# EasyEDA Pro project ProPrj_集成分电板_2025-09-23.epro

# Schematic Schematic1
Board Name: Board1; Create Date: 2025-09-23; Page Name: P1; Project Name: 集成分电板; Schematic Name: Schematic1; Update Date: 2025-09-23; Company: 嘉立创EDA; Page Size: A3; Version: V1.0
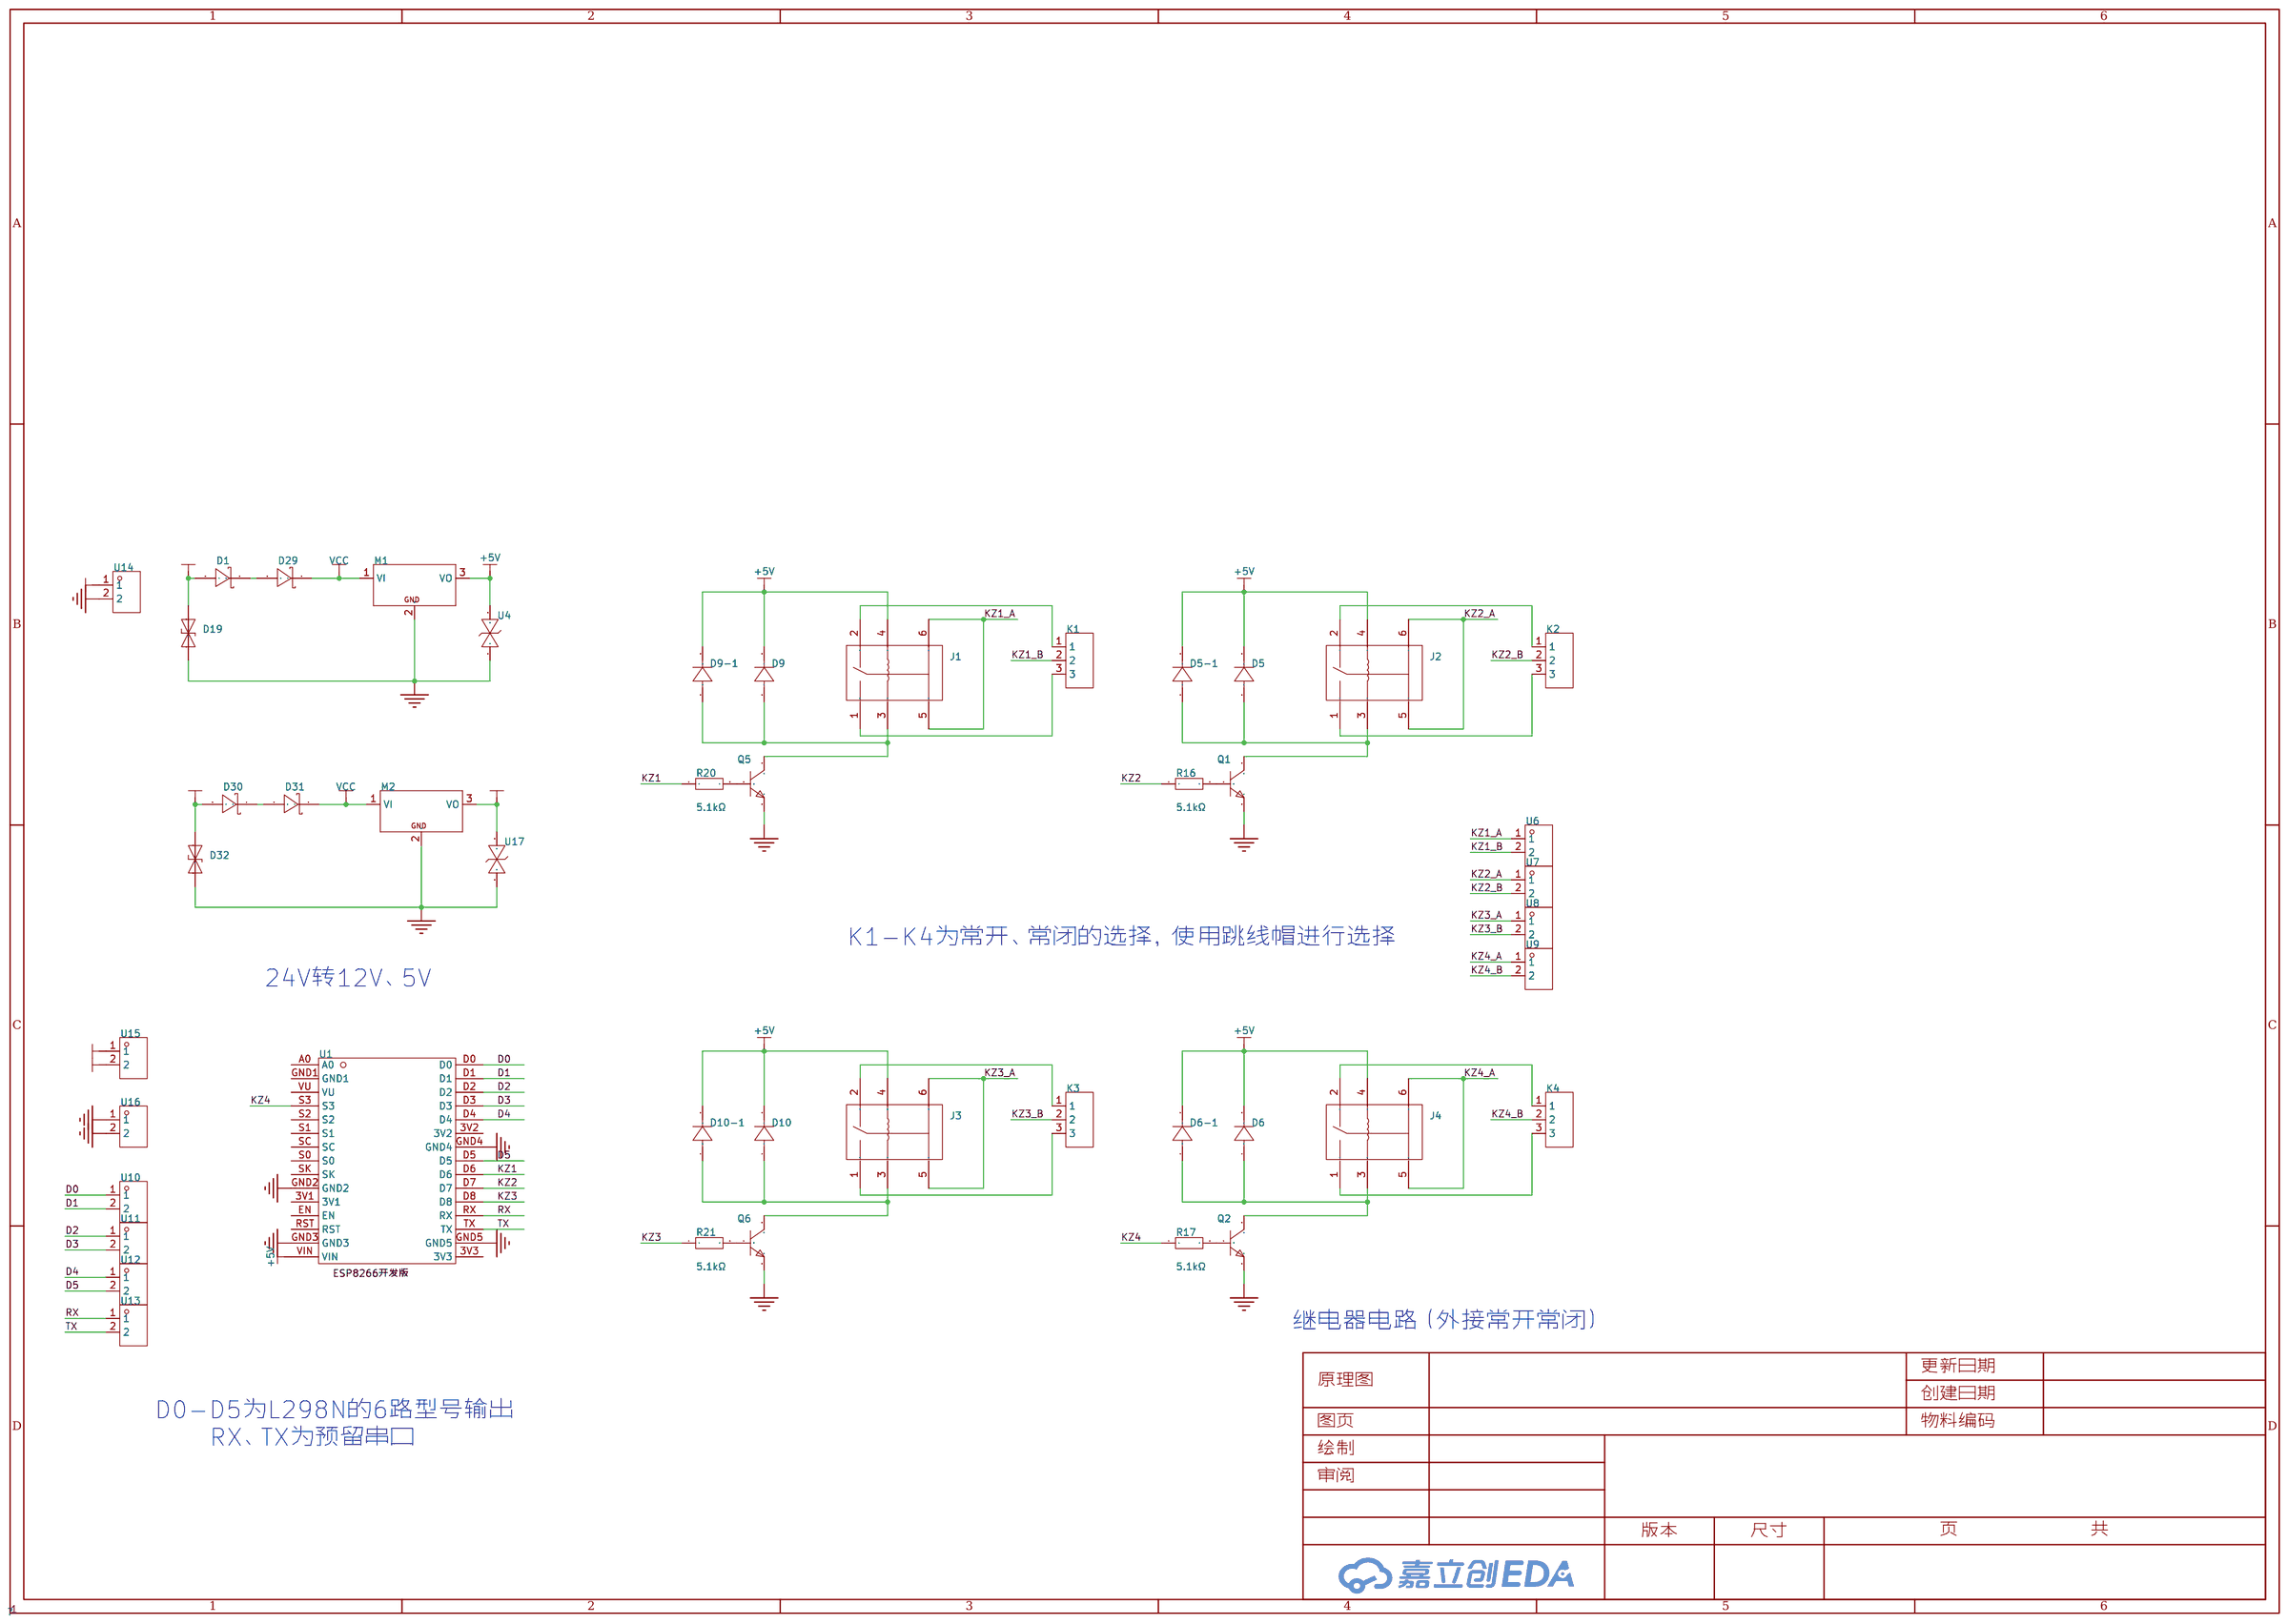
[diagram p0: schematic sheet]

## Parts
D1  SS14  [SMA_L4.2-W2.6-LS5.0-RD_1]
D5  1N4148WS  [SOD-323_L1.7-W1.3-LS2.5-FD]
D5-1  1N4148WS  [SOD-323_L1.7-W1.3-LS2.5-FD]
D6  1N4148WS  [SOD-323_L1.7-W1.3-LS2.5-FD]
D6-1  1N4148WS  [SOD-323_L1.7-W1.3-LS2.5-FD]
D9  1N4148WS  [SOD-323_L1.7-W1.3-LS2.5-FD]
D9-1  1N4148WS  [SOD-323_L1.7-W1.3-LS2.5-FD]
D10  1N4148WS  [SOD-323_L1.7-W1.3-LS2.5-FD]
D10-1  1N4148WS  [SOD-323_L1.7-W1.3-LS2.5-FD]
D19  SMCJ33CA  [SMC_L6.9-W5.9-LS7.9-BI]
D29  SS14  [SMA_L4.2-W2.6-LS5.0-RD_1]
D30  SS14  [SMA_L4.2-W2.6-LS5.0-RD_1]
D31  SS14  [SMA_L4.2-W2.6-LS5.0-RD_1]
D32  SMCJ33CA  [SMC_L6.9-W5.9-LS7.9-BI]
J1  HK4100F-DC5V-SHG  [RELAY-TH_HK4100F-DC5V-SHG]
J2  HK4100F-DC5V-SHG  [RELAY-TH_HK4100F-DC5V-SHG]
J3  HK4100F-DC5V-SHG  [RELAY-TH_HK4100F-DC5V-SHG]
J4  HK4100F-DC5V-SHG  [RELAY-TH_HK4100F-DC5V-SHG]
K1  PZ254V-11-03P  [HDR-TH_3P-P2.54-V-M]
K2  PZ254V-11-03P  [HDR-TH_3P-P2.54-V-M]
K3  PZ254V-11-03P  [HDR-TH_3P-P2.54-V-M]
K4  PZ254V-11-03P  [HDR-TH_3P-P2.54-V-M]
M1  K78L05-1000R3  [精英数智-24V转5V模块]
M2  K78L12-1000R3  [精英数智-24V转5V模块]
Q1  S9014  [SOT-23-3_L2.9-W1.3-P1.90-LS2.4-BR]
Q2  S9014  [SOT-23-3_L2.9-W1.3-P1.90-LS2.4-BR]
Q5  S9014  [SOT-23-3_L2.9-W1.3-P1.90-LS2.4-BR]
Q6  S9014  [SOT-23-3_L2.9-W1.3-P1.90-LS2.4-BR]
R16  5.1kΩ  [R0603]
R17  5.1kΩ  [R0603]
R20  5.1kΩ  [R0603]
R21  5.1kΩ  [R0603]
U1  -  [ESP8266开发板]
U4  SMBJ5.0CA  [SMB_L4.5-W3.6-LS5.2-BI]
U6  KF7.62-2P(green)  [CONN-TH_2P-P7.62_KEFA_KF7.62-2P]
U7  KF7.62-2P(green)  [CONN-TH_2P-P7.62_KEFA_KF7.62-2P]
U8  KF7.62-2P(green)  [CONN-TH_2P-P7.62_KEFA_KF7.62-2P]
U9  KF7.62-2P(green)  [CONN-TH_2P-P7.62_KEFA_KF7.62-2P]
U10  KF7.62-2P(green)  [CONN-TH_2P-P7.62_KEFA_KF7.62-2P]
U11  KF7.62-2P(green)  [CONN-TH_2P-P7.62_KEFA_KF7.62-2P]
U12  KF7.62-2P(green)  [CONN-TH_2P-P7.62_KEFA_KF7.62-2P]
U13  KF7.62-2P(green)  [CONN-TH_2P-P7.62_KEFA_KF7.62-2P]
U14  KF7.62-2P(green)  [CONN-TH_2P-P7.62_KEFA_KF7.62-2P]
U15  KF7.62-2P(green)  [CONN-TH_2P-P7.62_KEFA_KF7.62-2P]
U16  KF7.62-2P(green)  [CONN-TH_2P-P7.62_KEFA_KF7.62-2P]
U17  SMBJ12CA  [SMB_L4.6-W3.6-LS5.3-BI]

## Library data of the parts
D1 D29-D31 = SS14_C2480: 二极管配置:独立式;正向压降(Vf):550mV@1A;直流反向耐压(Vr):40V;整流电流:1A;; LCSC Part Name: 电压:40V 电流:1A; Supplier Part: C2480; Manufacturer: MDD(辰达半导体); Supplier Footprint: SMA(DO-214AC); JLCPCB Part Class: 基础库; Datasheet: https://atta.szlcsc.com/upload/public/pdf/source/20241121/B157EB417161760A7ED23035C0FAAB28.pdf; Supplier: LCSC; Diode Configuration: 独立式; Voltage - Forward(Vf@If): 550mV@1A; Voltage - DC Reverse(Vr): 40V; Current - Rectified: 1A; Reverse Leakage Current (Ir): 300uA@40V
D5 D5-1 D6 D6-1 D9 D9-1 D10 D10-1 = 1N4148WS_C7420319: 二极管配置:独立式;正向压降(Vf):1.25V@150mA;直流反向耐压(Vr):100V;整流电流:150mA;反向恢复时间(Trr):4ns;; Supplier Part: C7420319; Manufacturer: 宏嘉诚; Supplier Footprint: SOD-323; JLCPCB Part Class: Extended Part; Datasheet: https://item.szlcsc.com/datasheet/1N4148WS/8397141.html; Supplier: LCSC; Diode Configuration: 独立式; Forward Voltage (Vf@If): 1.25V@150mA; Reverse Voltage (Vr): 100V; Rectified Current: 150mA; Reverse Leakage Current (Ir): 1uA@75V; Reverse Recovery Time (trr): 4ns; Operating Temperature: -55℃~+150℃; Voltage - Forward(Vf@If): 1.25V@150mA; Voltage - DC Reverse(Vr): 100V; Current - Rectified: 150mA; Pd - Power Dissipation: 200mW; Operating Junction Temperature Range: -55℃~+150℃; Non-Repetitive Peak Forward Surge Current: 2A
D19 D32 = SMCJ33CA: 反向截止电压(Vrwm):33V;最大钳位电压:53.3V;峰值脉冲电流(Ipp):28.2A;击穿电压:36.7V;; Supplier Part: C356787; Manufacturer: JJW(捷捷微); Supplier Footprint: SMC(DO-214AB); Datasheet: https://atta.szlcsc.com/upload/public/pdf/source/20181226/C356793_C1FF0BB4994669FE0B6214A04E00432E.pdf; Supplier: LCSC; Reverse Stand-Off Voltage (Vrwm): 33V; Maximum Clamping Voltage: 53.3V; Peak Pulse Current (Ipp): 28.2A; Breakdown Voltage: 36.7V; Reverse Leakage Current (Ir): 1uA; Type: TVS
J1-J4 = HK4100F-DC5V-SHG: 线圈电压:-;触点形式:-;触点容量(电阻负载):-;最大切换电压:-;最大切换电流:-;; Supplier Part: C12072; Manufacturer: 汇科; Supplier Footprint: DIP,10.5x14.5mm; JLCPCB Part Class: Extended Part; Datasheet: https://atta.szlcsc.com/upload/public/pdf/source/20180316/5A66D26635AF047552DED4727B242686.pdf; Supplier: LCSC
K1-K4 = PZ254V-11-03P: 插针结构:1x3P;间距:2.54mm;行距:-;圆针/方针:方针;安装方式:直插;排数:单排;总PIN位数:3P;额定电流:3A;额定电压:250V;配合针长度:6mm;塑高:2.5mm;端接针长度:3mm;工作温度:-40℃~+105℃;颜色:黑色;; LCSC Part Name: 1x3P 间距:2.54mm 方针 直插; Supplier Part: C2937625; Manufacturer: XFCN(兴飞); Supplier Footprint: 插件,P=2.54mm; JLCPCB Part Class: Extended Part; Datasheet: https://item.szlcsc.com/datasheet/PZ254V-11-03P/3293280.html; Supplier: LCSC; Pin Structure: 1x3P; Pitch: 2.54mm; Circluar Pins/Square Pins: 方针; Mounting Type: 直插; Number of Rows: 单排; Number of Pins: 3P; Current Rating: 3A; Voltage Rating (Max): 250V; Length of Mating Pin: 6mm; Insulation Height: 2.5mm; Length of End Connection Pin: 3mm; Operating Temperature: -40℃~+105℃; Color: 黑色
M1 = K78L05-1000R3: 可正负配置  宽压输入 高效率 高性价比 无需散热 短路保护 支持负电压; LCSC Part Name: DC/DC模块电源，宽电压输入，非隔离稳压单路输出; Supplier Part: C115813; Manufacturer: MORNSUN(金升阳); Supplier Footprint: SIP,11.5x7.5mm; JLCPCB Part Class: Extended Part; Datasheet: https://item.szlcsc.com/datasheet/K78L05-1000R3/117064.html; Supplier: LCSC; Number of Outputs: 1; Voltage - Supply: 8V~36V; Output Voltage: -5V；5V; Output Current(Max): 1A；-500mA; Conversion Efficiency: 86%；93%
M2 = K78L12-1000R3: 可正负配置  宽压输入 高效率 高性价比 无需散热 短路保护 支持负电压; LCSC Part Name: DC/DC模块电源，宽电压输入，非隔离稳压单路输出; Supplier Part: C115814; Manufacturer: MORNSUN(金升阳); Supplier Footprint: SIP,11.5x7.5mm; JLCPCB Part Class: Extended Part; Datasheet: https://item.szlcsc.com/datasheet/K78L12-1000R3/117065.html; Supplier: LCSC; Number of Outputs: 1; Voltage - Supply: 8V~36V; Output Voltage: -12V；12V; Output Current(Max): 1A；-300mA; Conversion Efficiency: 89%；96%
Q1 Q2 Q5 Q6 = S9014_C2148: 晶体管类型:NPN;集电极电流(Ic):100mA;集射极击穿电压(Vceo):45V;耗散功率(Pd):200mW;直流电流增益(hFE):200@1mA,5V;; LCSC Part Name: J6  300-400 NPN 电流:0.1A 电压:45V; Supplier Part: C2148; Manufacturer: CJ(江苏长电/长晶); Supplier Footprint: SOT-23; JLCPCB Part Class: Extended Part; Datasheet: https://item.szlcsc.com/datasheet/S9014/2505.html; Supplier: LCSC; type: NPN; Current - Collector(Ic): 100mA; Collector - Emitter Voltage VCEO: 45V; Pd - Power Dissipation: 200mW; DC Current Gain: 200@1mA,5V; Transition frequency(fT): 150MHz; Current - Collector Cutoff: 100nA; Vce Saturation(VCE(sat)): 300mV@100mA,5mA; Operating Temperature: -55℃~+150℃; Emitter-Base Voltage(Vebo): 5V; Number: 1个NPN
R16 R17 R20 R21 = 0603WAF5101T5E: 电阻类型:厚膜电阻;阻值:5.1kΩ;精度:±1%;功率:100mW;工作电压:75V;温度系数:±100ppm/℃;; LCSC Part Name: 5.1kΩ ±1% 100mW 厚膜电阻; Supplier Part: C23186; Manufacturer: UNI-ROYAL(厚声); Supplier Footprint: 0603; JLCPCB Part Class: Basic Part; Datasheet: https://item.szlcsc.com/datasheet/0603WAF5101T5E/23913.html; Supplier: LCSC; Type: 厚膜电阻; Tolerance: ±1%; Power(Watts): 100mW; Voltage-Supply(Max): 75V; Temperature Coefficient: ±100ppm/℃; Operating Temperature: -55℃~+155℃
U1 = ESP8266开发板
U4 = SMBJ5.0CA_C19077559: 极性:双向;反向截止电压(Vrwm):5V;钳位电压:9.2V;峰值脉冲电流(Ipp):65.22A;峰值脉冲功率(Ppp):600W;击穿电压:7V;; Supplier Part: C19077559; Manufacturer: 宏嘉诚; Supplier Footprint: SMB; JLCPCB Part Class: 扩展库; Datasheet: https://atta.szlcsc.com/upload/public/pdf/source/20250107/474F05451FC8AB27D7FA0238914F96F6.pdf; Supplier: LCSC; Polarity: 双向; Reverse Stand-Off Voltage (Vrwm): 5V; Clamping Voltage: 9.2V; Peak Pulse Current (Ipp): 65.22A; Peak Pulse Power Dissipation (Ppp): 600W; Voltage - Breakdown: 7V; Reverse Leakage Current (Ir): 800uA; Type: TVS
U6-U16 = KF7.62-2P(green): LCSC Part Name: 绿色尼龙环保 KF7.62-2P(green); Supplier Part: C5173665; Manufacturer: KEFA(科发); Supplier Footprint: 插件,P=7.62mm; JLCPCB Part Class: Extended Part; Datasheet: https://item.szlcsc.com/datasheet/KF7.62-2P(green)/5823755.html; Supplier: LCSC
U17 = SMBJ12CA_C83849: 极性:双向;反向截止电压(Vrwm):12V;钳位电压:19.9V;峰值脉冲电流(Ipp):30.2A;峰值脉冲功率(Ppp):600W;击穿电压:13.3V;; Supplier Part: C83849; Manufacturer: Littelfuse(美国力特); Supplier Footprint: SMB(DO-214AA); JLCPCB Part Class: Extended Part; Datasheet: https://item.szlcsc.com/datasheet/SMBJ12CA/85016.html; Supplier: LCSC; Polarity: 双向; Reverse Stand-Off Voltage (Vrwm): 12V; Clamping Voltage: 19.9V; Peak Pulse Current (Ipp): 30.2A; Peak Pulse Power Dissipation (Ppp): 600W; Voltage - Breakdown: 13.3V; Type: TVS

## Nets
+5V: D5.2(K) D5-1.2(K) D6.2(K) D6-1.2(K) D9.2(K) D9-1.2(K) D10.2(K) D10-1.2(K) J1.4 J2.4 J3.4 J4.4 M1.3(VO) U1.VIN U4.2
+12V: M2.3(VO) U15.1 U15.2 U17.2
+24V: D1.2(A) D19.2(A) D30.2(A) D32.2(A) U14.1
GND: D19.1(K) D32.1(K) M1.2(GND) M2.2(GND) Q1.2(E) Q2.2(E) Q5.2(E) Q6.2(E) U1.GND2 U1.GND3 U1.GND4 U1.GND5 U4.1 U14.2 U16.1 U16.2 U17.1
VCC: D29.1(K) D31.1(K) M1.1(VI) M2.1(VI)
D0: U1.D0 U10.1
D1: U1.D1 U10.2
D2: U1.D2 U11.1
D3: U1.D3 U11.2
D4: U1.D4 U12.1
D5: U1.D5 U12.2
KZ1: R20.1 U1.D6
KZ1_A: J1.5 J1.6 U6.1
KZ1_B: K1.2 U6.2
KZ2: R16.1 U1.D7
KZ2_A: J2.5 J2.6 U7.1
KZ2_B: K2.2 U7.2
KZ3: R21.1 U1.D8
KZ3_A: J3.5 J3.6 U8.1
KZ3_B: K3.2 U8.2
KZ4: R17.1 U1.S3
KZ4_A: J4.5 J4.6 U9.1
KZ4_B: K4.2 U9.2
RX: U1.RX U13.1
TX: U1.TX U13.2
$1N2963: Q5.1(B) R20.2
$1N2967: D9.1(A) D9-1.1(A) J1.3 Q5.3(C)
$1N2971: J1.2 K1.1
$1N2972: J1.1 K1.3
$1N2975: Q1.1(B) R16.2
$1N2979: D5.1(A) D5-1.1(A) J2.3 Q1.3(C)
$1N2983: J2.2 K2.1
$1N2984: J2.1 K2.3
$1N2987: Q6.1(B) R21.2
$1N2991: D10.1(A) D10-1.1(A) J3.3 Q6.3(C)
$1N2995: J3.2 K3.1
$1N2996: J3.1 K3.3
$1N2999: Q2.1(B) R17.2
$1N3003: D6.1(A) D6-1.1(A) J4.3 Q2.3(C)
$1N3007: J4.2 K4.1
$1N3008: J4.1 K4.3
$1N3859: D1.1(K) D29.2(A)
$1N4413: D30.1(K) D31.2(A)

Not connected (* = marked no-connect by the designer): U1 3V1 3V2 3V3 A0 EN GND1 RST S0 S1 S2 SC SK VU

## Notes on the sheet
- K1-K4为常开、常闭的选择，使用跳线帽进行选择
- 24V转12V、5V
- 继电器电路（外接常开常闭）
- D0-D5为L298N的6路型号输出
- RX、TX为预留串口

# Board PCB1
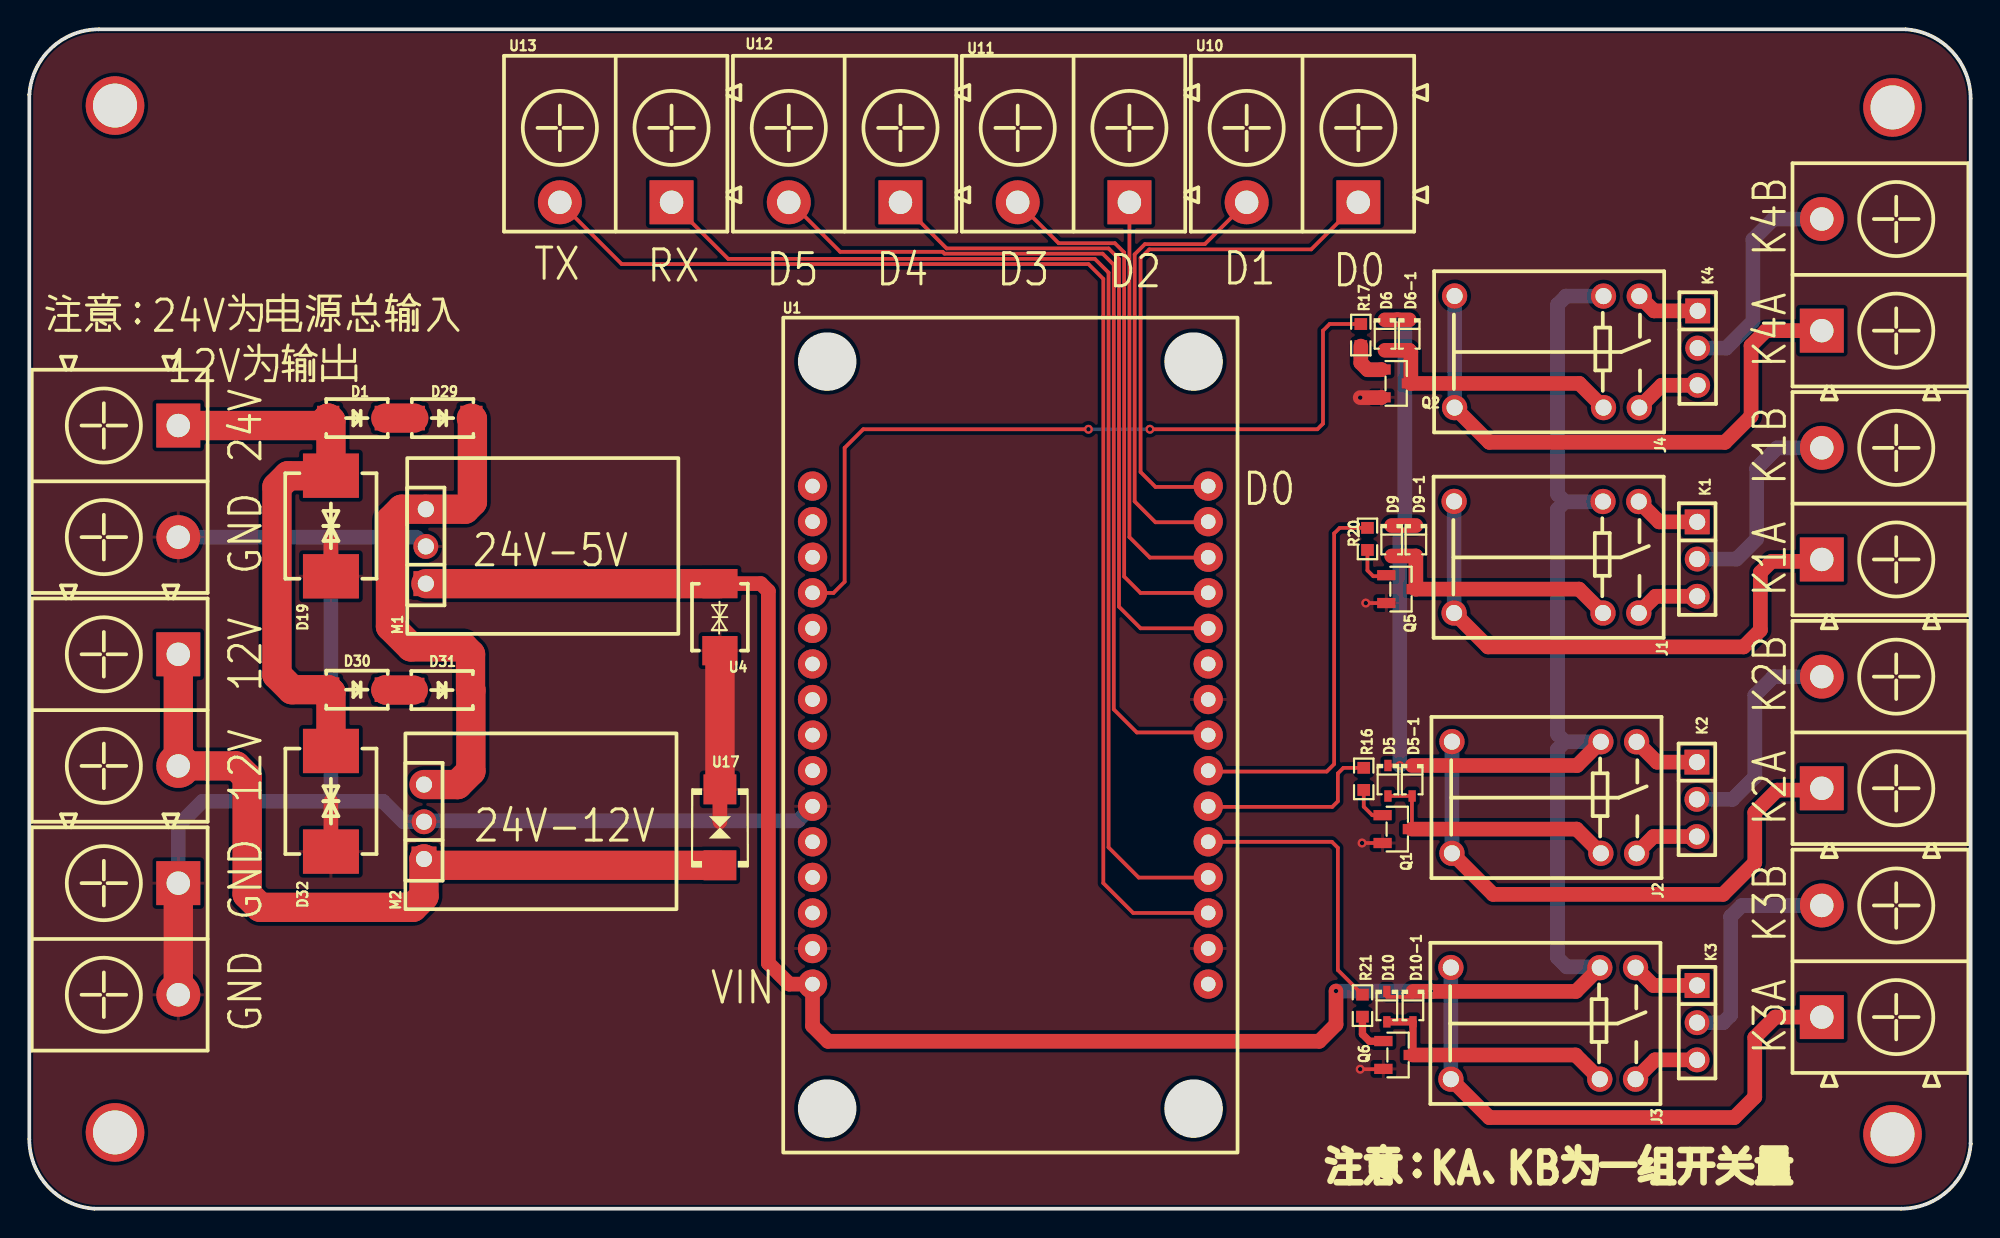
[diagram p1: board, top side]
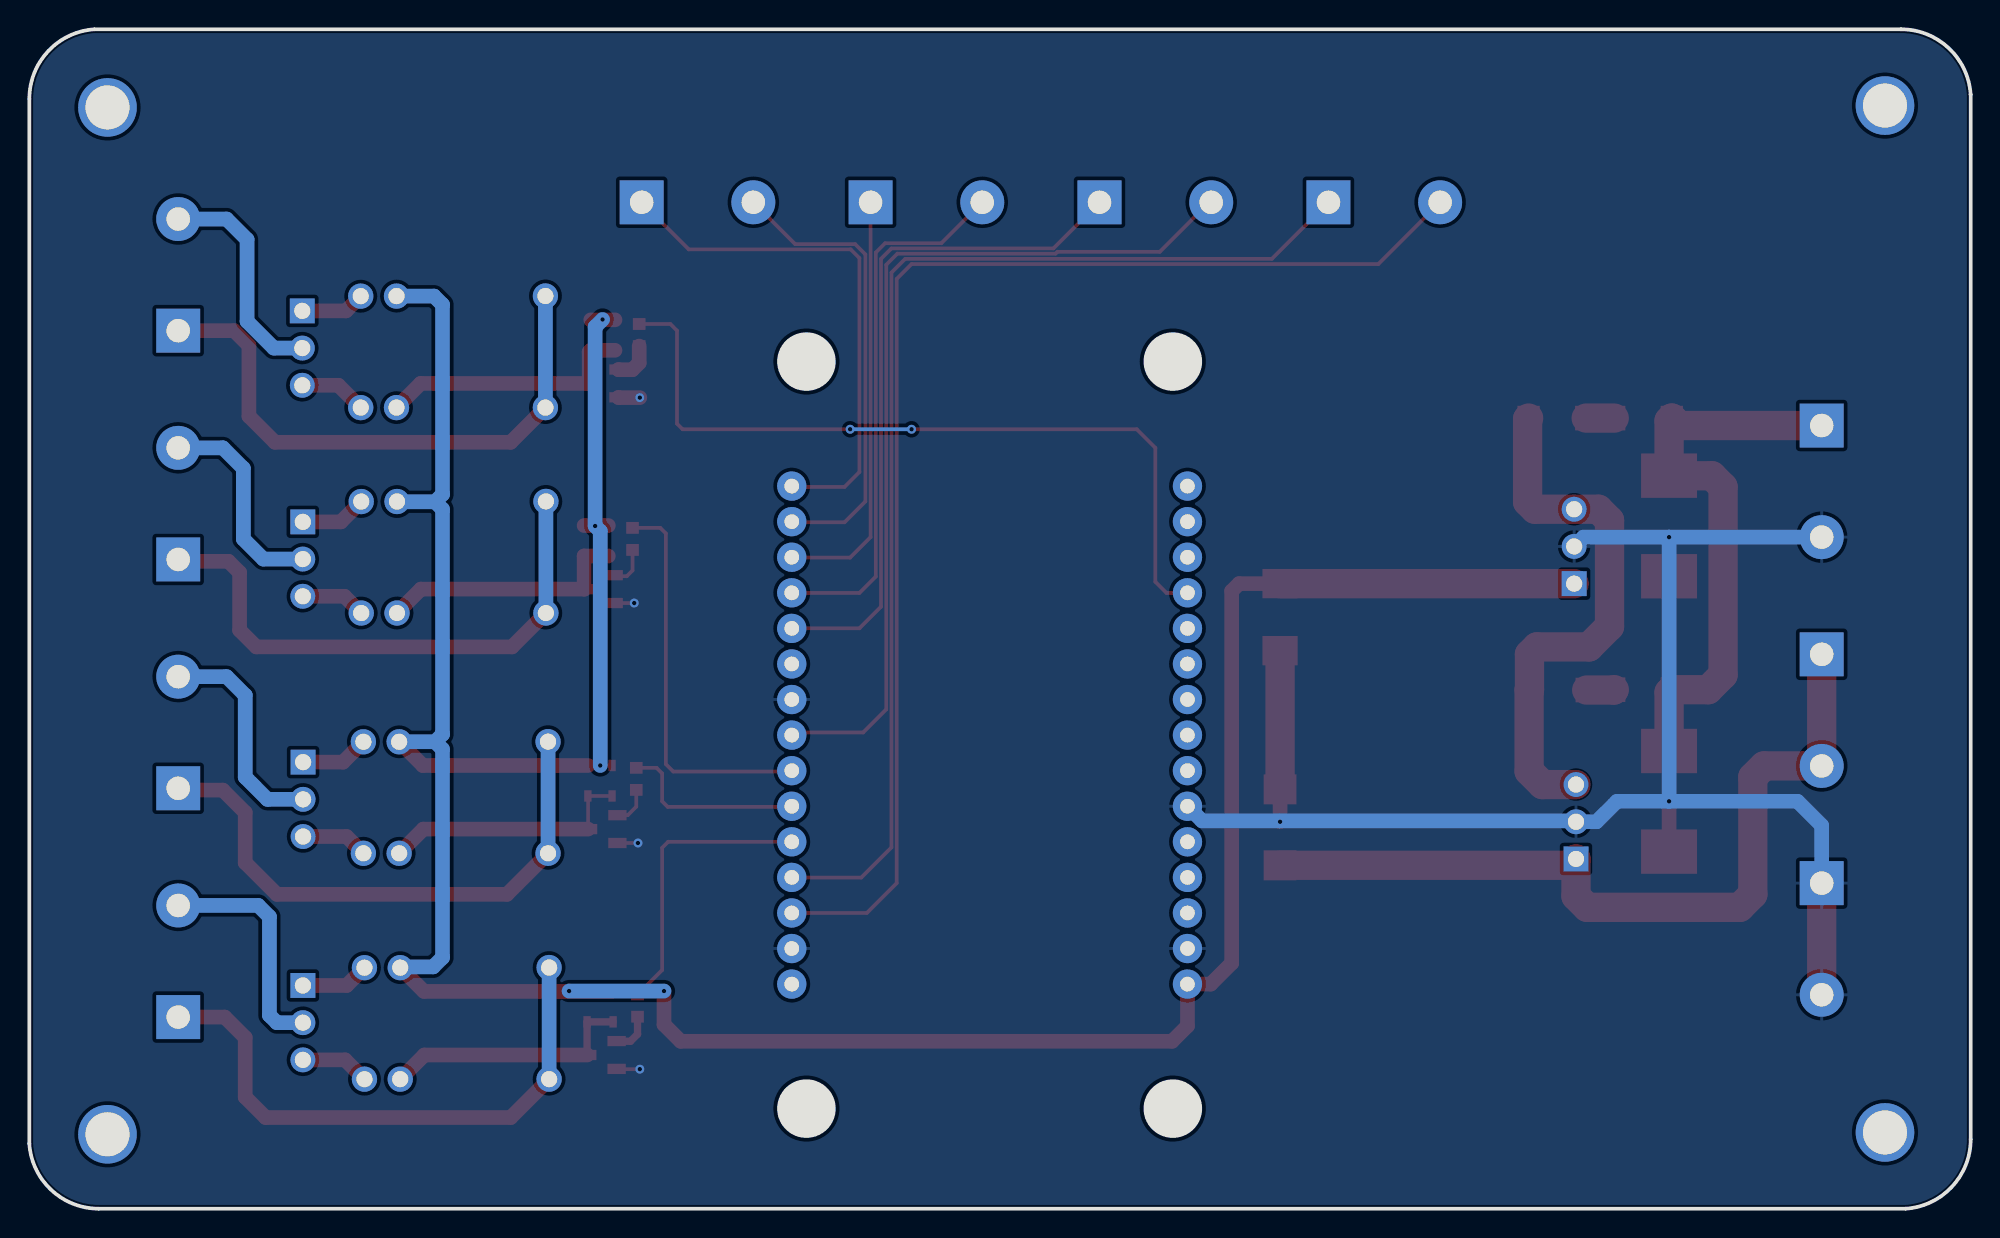
[diagram p2: board, bottom side, seen from below]

Outline 132.47 x 80.52 mm; copper layers: Top Layer, Bottom Layer. Coordinates in mm from the lower left corner of the outline.
Outline path: 0,76.07 0.01,76.08 arc(1.5,79.23) 4.75,80.52 128.02,80.52 arc(131.18,79.02) 132.46,75.77 132.46,4.45 132.47,4.44 arc(130.97,1.28) 127.72,0 4.44,0 arc(1.28,1.49) 0,4.74 0,76.07
Stack: Top Layer 0.035mm / Dielectric1 1.51mm FR4 er 4.5 / Bottom Layer 0.035mm

## Design rules (mm)
template: JLCPCB Capability(Two Layers Board)
spacing copperThickness1oz (default): track to track 0.102, other pairs 0.152 to 0.3
spacing copperThickness2oz: track to track 0.203, other pairs 0.152 to 0.3
track width copperThickness1oz (default): min 0.127, default 0.254, max 2.54
track width copperThickness2oz: min 0.203, default 0.254, max 2.54
differential pair differentialPair (default): width min 0.127, default 0.254, max 2.54; gap min 0.152, default 0.152
via viaSize (default): diameter min 0.5, default 0.61, max 10; hole min 0.3, default 0.305, max 6.3

## Placement (name value [footprint] x y rotation side)
D1  SS14  [SMA_L4.2-W2.6-LS5.0-RD_1]  22.36 53.98 180 top
D5  1N4148WS  [SOD-323_L1.7-W1.3-LS2.5-FD]  92.7 29.22 90 top
D5-1  1N4148WS  [SOD-323_L1.7-W1.3-LS2.5-FD]  94.36 29.22 90 top
D6  1N4148WS  [SOD-323_L1.7-W1.3-LS2.5-FD]  92.5 59.64 90 top
D6-1  1N4148WS  [SOD-323_L1.7-W1.3-LS2.5-FD]  94.15 59.64 90 top
D9  1N4148WS  [SOD-323_L1.7-W1.3-LS2.5-FD]  92.96 45.6 90 top
D9-1  1N4148WS  [SOD-323_L1.7-W1.3-LS2.5-FD]  94.61 45.6 90 top
D10  1N4148WS  [SOD-323_L1.7-W1.3-LS2.5-FD]  92.63 13.8 90 top
D10-1  1N4148WS  [SOD-323_L1.7-W1.3-LS2.5-FD]  94.41 13.8 90 top
D19  SMCJ33CA  [SMC_L6.9-W5.9-LS7.9-BI]  20.58 46.61 90 top
D29  SS14  [SMA_L4.2-W2.6-LS5.0-RD_1]  28.2 53.98 180 top
D30  SS14  [SMA_L4.2-W2.6-LS5.0-RD_1]  22.36 35.43 180 top
D31  SS14  [SMA_L4.2-W2.6-LS5.0-RD_1]  28.16 35.41 180 top
D32  SMCJ33CA  [SMC_L6.9-W5.9-LS7.9-BI]  20.58 27.81 90 top
J1  HK4100F-DC5V-SHG  [RELAY-TH_HK4100F-DC5V-SHG]  103.52 44.48 180 top
J2  HK4100F-DC5V-SHG  [RELAY-TH_HK4100F-DC5V-SHG]  103.37 28.07 180 top
J3  HK4100F-DC5V-SHG  [RELAY-TH_HK4100F-DC5V-SHG]  103.3 12.65 180 top
J4  HK4100F-DC5V-SHG  [RELAY-TH_HK4100F-DC5V-SHG]  103.55 58.5 180 top
K1  PZ254V-11-03P  [HDR-TH_3P-P2.54-V-M]  113.81 44.35 270 top
K2  PZ254V-11-03P  [HDR-TH_3P-P2.54-V-M]  113.79 27.95 270 top
K3  PZ254V-11-03P  [HDR-TH_3P-P2.54-V-M]  113.8 12.7 270 top
K4  PZ254V-11-03P  [HDR-TH_3P-P2.54-V-M]  113.84 58.75 270 top
M1  K78L05-1000R3  [精英数智-24V转5V模块]  25.79 39.24 90 top
M2  K78L12-1000R3  [精英数智-24V转5V模块]  25.66 20.45 90 top
NOREF  -  [Pad_e829]  5.85 5.21 0 top
NOREF#2  -  [Pad_e934]  127.13 5.08 0 top
NOREF#3  -  [Pad_e827]  127.13 75.18 0 top
NOREF#4  -  [Pad_e830]  5.85 75.31 0 top
Q1  S9014  [SOT-23-3_L2.9-W1.3-P1.90-LS2.4-BR]  93.34 25.92 180 top
Q2  S9014  [SOT-23-3_L2.9-W1.3-P1.90-LS2.4-BR]  93.27 56.34 180 top
Q5  S9014  [SOT-23-3_L2.9-W1.3-P1.90-LS2.4-BR]  93.59 42.3 180 top
Q6  S9014  [SOT-23-3_L2.9-W1.3-P1.90-LS2.4-BR]  93.39 10.5 180 top
R16  5.1kΩ  [R0603]  91.05 29.34 270 top
R17  5.1kΩ  [R0603]  90.85 59.64 270 top
R20  5.1kΩ  [R0603]  91.31 45.73 270 top
R21  5.1kΩ  [R0603]  90.96 13.86 270 top
U1  -  [ESP8266开发板]  51.44 60.83 0 top
U4  SMBJ5.0CA  [SMB_L4.5-W3.6-LS5.2-BI]  47.12 40.39 90 top
U6  KF7.62-2P(green)  [CONN-TH_2P-P7.62_KEFA_KF7.62-2P]  122.31 48.13 90 top
U7  KF7.62-2P(green)  [CONN-TH_2P-P7.62_KEFA_KF7.62-2P]  122.31 32.51 90 top
U8  KF7.62-2P(green)  [CONN-TH_2P-P7.62_KEFA_KF7.62-2P]  122.31 16.89 90 top
U9  KF7.62-2P(green)  [CONN-TH_2P-P7.62_KEFA_KF7.62-2P]  122.31 63.75 90 top
U10  KF7.62-2P(green)  [CONN-TH_2P-P7.62_KEFA_KF7.62-2P]  86.87 68.71 180 top
U11  KF7.62-2P(green)  [CONN-TH_2P-P7.62_KEFA_KF7.62-2P]  71.25 68.71 180 top
U12  KF7.62-2P(green)  [CONN-TH_2P-P7.62_KEFA_KF7.62-2P]  55.63 68.71 180 top
U13  KF7.62-2P(green)  [CONN-TH_2P-P7.62_KEFA_KF7.62-2P]  40.01 68.71 180 top
U14  KF7.62-2P(green)  [CONN-TH_2P-P7.62_KEFA_KF7.62-2P]  10.17 49.66 270 top
U15  KF7.62-2P(green)  [CONN-TH_2P-P7.62_KEFA_KF7.62-2P]  10.17 34.04 270 top
U16  KF7.62-2P(green)  [CONN-TH_2P-P7.62_KEFA_KF7.62-2P]  10.17 18.42 270 top
U17  SMBJ12CA  [SMB_L4.6-W3.6-LS5.3-BI]  47.12 26.04 270 top

## Footprints (pads in the part's own frame, mm; a bottom-side part is the same pattern mirrored in y, then rotated)
CONN-TH_2P-P7.62_KEFA_KF7.62-2P
  rect 3x3 hole 1.6: 1(-3.81,0)
  round 3 hole 1.6: 2(3.81,0)
ESP8266开发板
  round 2 hole 1: 3V1(2,-35.785) 3V2(29,-23.643) 3V3(29,-45.5) A0(2,-11.5) D0(29,-11.5) D1(29,-13.928) D2(29,-16.357) D3(29,-18.785) D4(29,-21.215) D5(29,-28.5) D6(29,-30.928) D7(29,-33.357) D8(29,-35.785) EN(2,-38.215) GND1(2,-13.928) GND2(2,-33.357) GND3(2,-43.072) GND4(29,-26.072) GND5(29,-43.072) RST(2,-40.643) RX(29,-38.215) S0(2,-28.5) S1(2,-23.643) S2(2,-21.215) S3(2,-18.785) SC(2,-26.072) SK(2,-30.928) TX(29,-40.643) VIN(2,-45.5) VU(2,-16.357)
HDR-TH_3P-P2.54-V-M
  rect 1.7x1.7 hole 1.1: 1(-2.54,0)
  round 1.7 hole 1.1: 2(0,0) 3(2.54,0)
Pad_e827
  round 4 hole 3: 1(0,0)
Pad_e829
  round 4 hole 3: 1(0,0)
Pad_e830
  round 4 hole 3: 1(0,0)
Pad_e934
  round 4 hole 3: 1(0,0)
R0603
  rect 0.806x0.864 smd: 1(-0.753,0) 2(0.753,0)
RELAY-TH_HK4100F-DC5V-SHG
  round 1.727 hole 1.1: 1(-6.301,3.81) 2(-6.301,-3.8) 3(-3.86,3.81) 4(-3.86,-3.803) 5(6.301,3.81) 6(6.301,-3.81)
SMA_L4.2-W2.6-LS5.0-RD_1
  rect 1.52x1.68 smd: 1(-1.965,0) 2(1.965,0)
SMB_L4.5-W3.6-LS5.2-BI
  rect 2x2.4 smd: 1(-2.288,0) 2(2.288,0)
SMB_L4.6-W3.6-LS5.3-BI
  rect 2.047x2.241 smd: 1(-2.591,0) 2(2.591,0)
SMC_L6.9-W5.9-LS7.9-BI
  rect 3.03x3.82 smd: 1(-3.435,0) 2(3.435,0)
SOD-323_L1.7-W1.3-LS2.5-FD
  rect 0.78x0.5 smd: 1(-1.04,0) 2(1.04,0)
SOT-23-3_L2.9-W1.3-P1.90-LS2.4-BR
  rect 1.25x0.7 smd: 1(1,-0.95) 2(1,0.95) 3(-1,0)
精英数智-24V转5V模块
  round 1.7 hole 1.1: 1(8.509,-1.27) 2(5.969,-1.27)
  rect 1.7x1.7 hole 1.1: 3(3.429,-1.27)

## Nets
As in the schematic.

Pads without a net: NOREF 1; NOREF#2 1; NOREF#3 1; NOREF#4 1; U1 3V1 3V2 3V3 A0 EN GND1 RST S0 S1 S2 SC SK VU

## Via types
v1: diameter 0.61, hole 0.305, Top Layer to Bottom Layer, 14 vias

## Routing (per net, layer and track width the routed paths; a pad name or vN(x,y) marks a point on that pad's centre or on a via; arc(x,y) is an arc through that point)
+5V: length 222.4
  Top Layer w0.254: D5.2 v1(93.51,30.26) D5-1.2 ; 92.63,14.46 94.41,14.46 ; 93.35,60.68 93.35,60.7 v1(93.35,60.71)
  Top Layer w1: D9-1.2 D9.2 ; U4.2 49.92,42.67 50.43,42.16 50.43,16.76 51.86,15.33 U1.VIN 53.44,12.48 54.49,11.43 88.02,11.43 89.16,12.57 v1(89.16,14.86) ; D10-1.2 95.67,14.84 ; 95.67,14.84 105.54,14.84 J3.4 ; 95.67,14.84 95.65,14.86 v1(95.64,14.86) ; D5-1.2 105.61,30.26 J2.4 ; D6-1.2 D6.2
  Top Layer w2: M1.3 47.12,42.67
  Bottom Layer w1: 104.78,31.88 104.27,31.37 104.27,17.15 104.91,16.51 107.1,16.51 J3.4 ; 104.78,31.88 104.27,32.39 104.27,47.75 104.78,48.26 ; 104.78,31.88 107.23,31.88 ; 104.78,48.26 104.27,48.77 104.27,61.72 104.85,62.3 J4.4 ; 104.78,48.26 107.36,48.26 J1.4 ; v1(93.35,60.71) 93.86,60.2 v1(93.86,46.61) 93.51,46.26 v1(93.51,30.26) ; v1(89.16,14.86) v1(95.64,14.86)
+12V: length 56.3
  Top Layer w2: U17.2 27.36,23.44 M2.3 26.93,21.34 26.17,20.57 15.75,20.57 14.87,21.46 14.87,29.46 14.1,30.23 U15.2 U15.1
+24V: length 39.5
  Top Layer w2: D32.2 20.58,35.25 D30.2 17.91,35.43 16.9,36.45 16.9,49.28 17.66,50.04 20.57,50.04 D19.2 20.58,53.79 D1.2 19.89,53.47 U14.1
GND: length 115.4
  Top Layer w0.254: Q5.2 v1(91.19,41.35) ; v1(90.81,9.53) 92.37,9.53 Q6.2 ; Q1.2 v1(90.94,24.97)
  Top Layer w1: D32.1 v1(20.58,27.81) ; v1(90.81,55.37) 92.25,55.37 Q2.2 ; U17.1 v1(47.12,26.42) ; D19.1 v1(20.58,45.85)
  Top Layer w2: U4.1 U17.1 ; U16.2 U16.1
  Bottom Layer w0.254: 47.16,26.48 47.16,26.45 v1(47.12,26.42)
  Bottom Layer w1: v1(20.58,27.81) 11.82,27.81 10.17,26.16 U16.1 ; v1(20.58,27.81) 24.14,27.81 25.53,26.42 M2.2 26.99,26.48 52.44,26.48 U1.GND2 ; v1(20.58,27.81) v1(20.58,45.85) ; v1(20.58,45.85) 26.42,45.85 M1.2 ; v1(20.58,45.85) U14.2
VCC: length 36.9
  Top Layer w2: D29.1 30.23,53.91 30.23,48.26 29.72,47.75 M1.1 25.41,47.75 24.64,46.99 24.64,39.75 26.04,38.35 29.6,38.35 30.11,37.85 30.11,35.43 D31.1 30.13,29.87 29.22,28.96 M2.1
D0: length 36.1
  Top Layer w0.254: U10.1 87.47,65.49 76.42,65.49 75.83,64.9 75.83,50.29 76.84,49.28 80.38,49.28 U1.D0
D1: length 31.6
  Top Layer w0.254: U1.D1 80.4,46.86 76.84,46.86 75.42,48.29 75.42,65.15 76.12,65.85 80.21,65.85 U10.2
D2: length 28.8
  Top Layer w0.254: U11.1 75.06,45.85 76.46,44.45 80.42,44.45 U1.D2
D3: length 37
  Top Layer w0.254: U11.2 70.24,65.91 74.07,65.91 74.71,65.28 74.71,43.16 75.83,42.04 80.43,42.04 U1.D3
D4: length 47
  Top Layer w0.254: U1.D4 80.44,39.62 75.83,39.62 74.35,41.1 74.35,64.85 73.64,65.56 62.59,65.56 U12.1
D5: length 61.5
  Top Layer w0.254: U12.2 51.95,68.71 55.33,65.33 62.32,65.33 62.45,65.2 73.24,65.2 74,64.44 74,34.09 75.57,32.51 80.39,32.51 80.44,32.46 U1.D5
KZ1: length 27
  Top Layer w0.254: U1.D6 80.5,29.85 88.53,29.85 89.03,30.35 89.03,46.1 89.41,46.48 R20.1
KZ1_A: length 38.4
  Top Layer w1: J1.5 99.53,38.35 116.97,38.35 118.12,39.5 118.12,43.43 118.88,44.2 122.18,44.2 U6.1
  Bottom Layer w1: J1.5 J1.6
KZ1_B: length 14.5
  Bottom Layer w1: K1.2 116.49,44.35 117.86,45.72 117.86,50.55 119.26,51.94 U6.2
KZ2: length 12.8
  Top Layer w0.254: R16.1 89.67,30.1 89.29,29.72 89.29,27.81 88.91,27.43 80.49,27.43 U1.D7
KZ2_A: length 39
  Top Layer w1: J2.5 99.87,21.46 115.58,21.46 117.74,23.62 117.74,27.05 119.26,28.58 122.18,28.58 U7.1
  Bottom Layer w1: J2.5 J2.6
KZ2_B: length 15.3
  Bottom Layer w1: U7.2 119.01,36.32 117.74,35.05 117.74,29.46 116.22,27.95 K2.2
KZ3: length 19.7
  Top Layer w0.254: R21.1 89.29,16.29 89.29,24.64 88.88,25.05 U1.D8
KZ3_A: length 39.2
  Top Layer w1: J3.5 99.62,6.22 116.34,6.22 117.74,7.62 117.74,11.68 119.13,13.08 U8.1
  Bottom Layer w1: J3.6 J3.5
KZ3_B: length 15.8
  Bottom Layer w1: K3.2 115.58,12.7 116.08,13.21 116.08,19.94 116.85,20.7 U8.2
KZ4: length 54.1
  Top Layer w0.254: v1(72.27,53.21) 56.9,53.21 55.63,51.94 55.63,42.8 54.87,42.04 53.45,42.04 U1.S3 ; v1(76.46,53.21) 87.89,53.21 88.27,53.59 88.27,59.94 88.72,60.4 R17.1
  Bottom Layer w0.254: v1(76.46,53.21) v1(72.27,53.21)
KZ4_A: length 39.6
  Top Layer w1: 122.31,59.94 118.5,59.94 117.48,58.93 117.48,54.1 115.7,52.32 99.62,52.32 J4.5
  Bottom Layer w1: J4.5 J4.6
KZ4_B: length 15.4
  Bottom Layer w1: U9.2 119.01,67.56 117.61,66.17 117.61,60.58 115.78,58.75 K4.2
RX: length 78.7
  Top Layer w0.254: U1.RX 80.43,22.61 75.7,22.61 73.64,24.67 73.64,63.91 72.7,64.85 47.68,64.85 U13.1
TX: length 88.5
  Top Layer w0.254: U1.TX 75.32,20.19 73.28,22.23 73.28,63.48 72.27,64.49 40.42,64.49 U13.2
$1N2963: length 2.9
  Top Layer w0.254: R20.2 91.31,43.57 91.7,43.18 92.52,43.18 Q5.1
$1N2967: length 17.4
  Top Layer w1: J1.3 105.75,42.3 Q5.3 94.61,42.31 94.61,44.56 92.96,44.56
$1N2971: length 4.6
  Top Layer w1: J1.2 111.21,46.89 K1.1
$1N2972: length 4.5
  Top Layer w1: J1.1 110.96,41.81 K1.3
$1N2975: length 2.7
  Top Layer w0.254: Q1.1 91.63,26.87 91.05,27.44 R16.2
$1N2979: length 17.5
  Top Layer w0.254: Q1.3 94.34,28.16 D5-1.1 D5.1
  Top Layer w1: Q1.3 105.58,25.92 J2.3
$1N2983: length 4.7
  Top Layer w1: J2.2 111.06,30.49 K2.1
$1N2984: length 4.6
  Top Layer w1: J2.1 110.82,25.41 K2.3
$1N2987: length 2.8
  Top Layer w0.5: R21.2 90.96,11.91 91.45,11.43 92.38,11.43 Q6.1
$1N2991: length 17.5
  Top Layer w0.5: D10.1 D10-1.1 94.41,10.51 Q6.3
  Top Layer w1: J3.3 105.51,10.5 Q6.3
$1N2995: length 4.7
  Top Layer w1: J3.2 110.81,15.24 K3.1
$1N2996: length 4.7
  Top Layer w1: 113.8,10.16 110.92,10.16 J3.1
$1N2999: length 2.8
  Top Layer w1: R17.2 90.85,57.74 91.32,57.28 92.25,57.28 Q2.1
$1N3003: length 17.8
  Top Layer w1: J4.3 105.76,56.34 Q2.3 94.27,58.49 D6-1.1 D6.1
$1N3007: length 4.4
  Top Layer w1: J4.2 110.86,61.3 K4.1
$1N3008: length 4.6
  Top Layer w1: K4.3 111.38,56.22 J4.1
$1N3859: length 1.9
  Top Layer w2: D1.1 D29.2
$1N4413: length 1.9
  Top Layer w2: D30.1 24.35,35.41 D31.2

## Copper pours and planes (outline as drawn; the poured copper is in the pictures)
GND on Top Layer: 0.01,80.52 132.47,80.52 132.47,0 0.01,0
GND on Bottom Layer: 0.01,80.52 132.47,80.52 132.47,0 0.01,0

## Text on the board
Top Silkscreen Layer: TX | RX | D5 | D4 | D3 | D2 | D1 | D0 | 24V | GND | 12V | K4B | K4A | K1B | K1A | K2B | K2A | K3B | K3A | 24V-5V | 24V-12V | VIN | 注意：KA、KB为一组开关量 | 注意：24V为电源总输入 / 12V为输出
